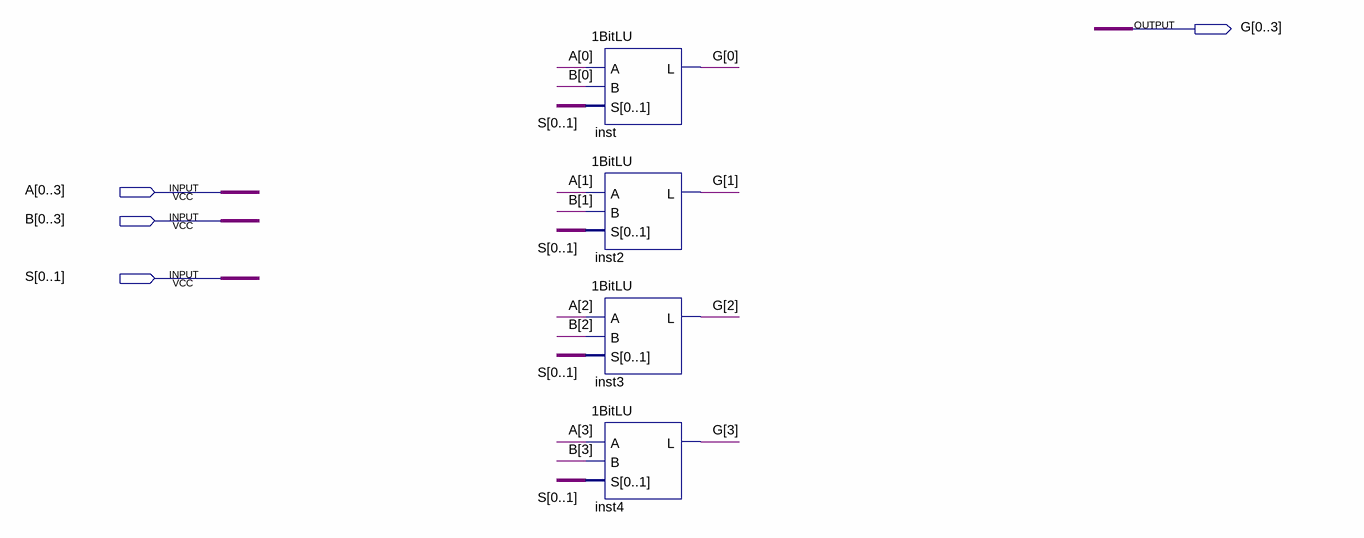
[diagram p0: schematic sheet]
// Quartus schematic 4BitLU.bdf as structural Verilog: 4 symbols, 4 pins
module \4BitLU  (
  input  [0:3] A,
  input  [0:3] B,
  input  [0:1] S,
  output [0:3] G
);

  \1BitLU  inst (.A(A[0]), .B(B[0]), .S(S), .L(G[0]));
  \1BitLU  inst2 (.A(A[1]), .B(B[1]), .S(S), .L(G[1]));
  \1BitLU  inst3 (.A(A[2]), .B(B[2]), .S(S), .L(G[2]));
  \1BitLU  inst4 (.A(A[3]), .B(B[3]), .S(S), .L(G[3]));
endmodule
